# EAGLE schematic Headers (EAGLE 8.0.1)
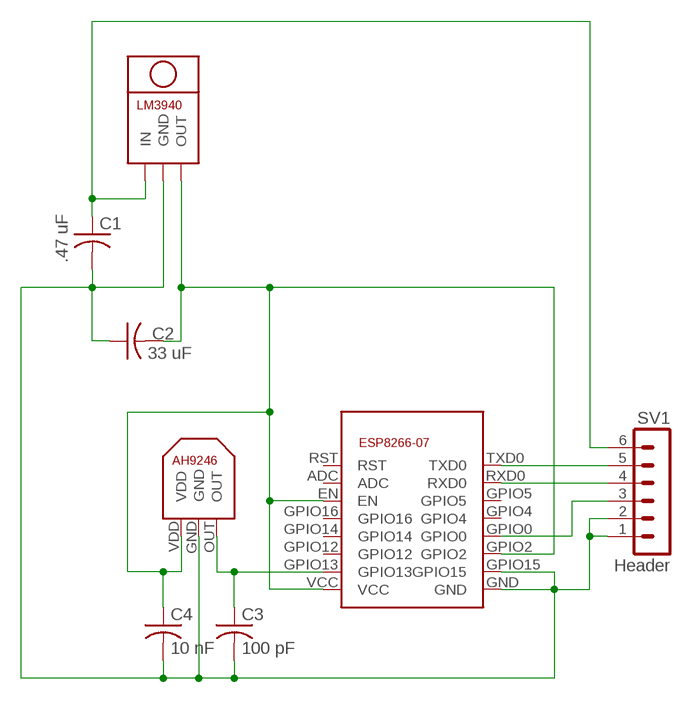
[diagram p0: schematic, sheet 1]

## Parts
C1  .47 uF  C-US025-050X050  [C025-050X050]
C2  33 uF  C-US025-050X050  [C025-050X050]
C3  100 pF  C-US025-050X050  [C025-050X050]
C4  10 nF  C-US025-050X050  [C025-050X050]
SV1  Header  MA06-1  [MA06-1]
U$1  ESP8266-07  [ESP8266-07]
U$2  LM3940  [LM3940]
U$3  AH9246  [AH9246]

## Nets
N$1: C3.1 U$1.GPIO13 U$3.OUT
N$3: C2.2 C4.1 U$1.EN U$1.GPIO2 U$1.VCC U$2.OUT U$3.VDD
N$4: C1.1 SV1.6 U$2.IN
N$5: C1.2 C2.1 C3.2 C4.2 SV1.1 SV1.2 U$1.GND U$1.GPIO15 U$2.GND U$3.GND
N$7: SV1.5 U$1.TXD0
N$8: SV1.4 U$1.RXD0
N$9: SV1.3 U$1.GPIO0
Unconnected: U$1.ADC U$1.GPIO4 U$1.GPIO5 U$1.GPIO12 U$1.GPIO14 U$1.GPIO16 U$1.RST

## Library data of the parts
C1-C4 = rcl:C-US: CAPACITOR, American symbol
SV1 = con-lstb:MA06-1: PIN HEADER; OC_FARNELL: unknown; OC_NEWARK: unknown
U$1 = IoT:ESP8266-07
U$2 = IoT:LM3940
U$3 = IoT:AH9246